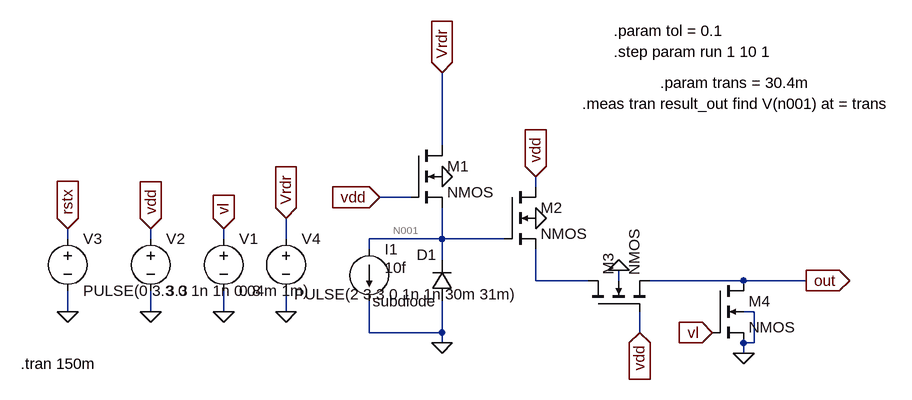
[diagram p0: schematic LOG 2015.asc]
LOG 2015.asc, the LTspice schematic file:
Version 4
SHEET 1 1372 680
WIRE 336 16 336 -96
WIRE 480 80 480 64
WIRE 288 96 240 96
WIRE -240 160 -240 144
WIRE -112 160 -112 144
WIRE 0 160 0 144
WIRE 96 160 96 128
WIRE 336 160 336 112
WIRE 336 160 224 160
WIRE 432 160 336 160
WIRE 224 176 224 160
WIRE 336 192 336 160
WIRE 480 224 480 176
WIRE 560 224 480 224
WIRE 608 224 608 208
WIRE 800 224 656 224
WIRE 896 224 800 224
WIRE -240 272 -240 240
WIRE -112 272 -112 240
WIRE 0 272 0 240
WIRE 96 272 96 240
WIRE 816 272 800 272
WIRE 224 304 224 256
WIRE 336 304 336 256
WIRE 336 304 224 304
WIRE 640 304 640 272
WIRE 336 320 336 304
WIRE 800 320 800 304
WIRE 816 320 816 272
WIRE 816 320 800 320
WIRE 800 336 800 320
FLAG 0 272 0
FLAG -112 272 0
FLAG -240 272 0
FLAG -240 144 rstx
IOPIN -240 144 In
FLAG 336 64 0
FLAG 336 320 0
FLAG 336 -96 Vrdr
IOPIN 336 -96 In
FLAG -112 144 vdd
IOPIN -112 144 In
FLAG 480 128 0
FLAG 800 336 0
FLAG 752 304 vl
IOPIN 752 304 In
FLAG 0 144 vl
IOPIN 0 144 In
FLAG 96 128 Vrdr
IOPIN 96 128 In
FLAG 96 272 0
FLAG 480 64 vdd
IOPIN 480 64 In
FLAG 608 208 0
FLAG 640 304 vdd
IOPIN 640 304 In
FLAG 896 224 out
IOPIN 896 224 Out
FLAG 240 96 vdd
IOPIN 240 96 In
SYMBOL voltage 0 144 R0
WINDOW 123 0 0 Left 2
WINDOW 39 0 0 Left 2
SYMATTR InstName V1
SYMATTR Value 0.8
SYMBOL voltage -112 144 R0
WINDOW 123 0 0 Left 2
WINDOW 39 0 0 Left 2
SYMATTR InstName V2
SYMATTR Value 3.3
SYMBOL voltage -240 144 R0
WINDOW 123 24 132 Left 2
WINDOW 39 0 0 Left 2
SYMATTR InstName V3
SYMATTR Value PULSE(0 3.3 0 1n 1n 0.04m 1m)
SYMBOL nmos4 288 16 R0
SYMATTR InstName M1
SYMATTR Value2 l={mc(35u,tol)} w={mc(70u,tol)}
SYMBOL nmos4 432 80 R0
SYMATTR InstName M2
SYMATTR Value2 l={mc(35u,tol)} w={mc(70u,tol)}
SYMBOL nmos4 752 224 R0
SYMATTR InstName M4
SYMBOL diode 352 256 R180
WINDOW 0 24 72 Left 2
WINDOW 3 24 0 Left 2
SYMATTR InstName D1
SYMATTR Value subdiode
SYMBOL current 224 176 R0
WINDOW 3 24 28 Left 2
WINDOW 123 0 0 Left 2
WINDOW 39 0 0 Left 2
SYMATTR Value 10f
SYMATTR InstName I1
SYMBOL voltage 96 144 R0
WINDOW 123 0 0 Left 2
WINDOW 39 0 0 Left 2
WINDOW 3 185 117 Bottom 2
SYMATTR Value PULSE(2 3.3 0 1n 1n 30m 31m)
SYMATTR InstName V4
SYMBOL nmos4 560 272 R270
SYMATTR InstName M3
SYMATTR Value2 l={mc(35u,tol)} w={mc(70u,tol)}
TEXT -312 352 Left 2 !.tran 150m
TEXT 600 -160 Left 2 !.param tol = 0.1
TEXT 600 -128 Left 2 !.step param run 1 10 1
TEXT 672 -80 Left 2 !.param trans = 30.4m
TEXT 552 -48 Left 2 !.meas tran result_out find V(n001) at = trans

The netlist it stands for:
* LOG 2015.asc
V1 vl 0 0.8
V2 vdd 0 3.3
V3 rstx 0 PULSE(0 3.3 0 1n 1n 0.04m 1m)
M1 Vrdr vdd N001 0 NMOS l={mc(35u,tol)} w={mc(70u,tol)}
M2 vdd N001 N002 0 NMOS l={mc(35u,tol)} w={mc(70u,tol)}
M4 out vl 0 0 NMOS
D1 0 N001 subdiode
I1 N001 0 10f
V4 Vrdr 0 PULSE(2 3.3 0 1n 1n 30m 31m)
M3 N002 vdd out 0 NMOS l={mc(35u,tol)} w={mc(70u,tol)}
.model D D
.lib standard.dio
.model NMOS NMOS
.model PMOS PMOS
.lib standard.mos
.tran 150m
.param tol = 0.1
.step param run 1 10 1
.param trans = 30.4m
.meas tran result_out find V(n001) at = trans
.backanno
.end